# Altium project CAN to USB.PrjPcb
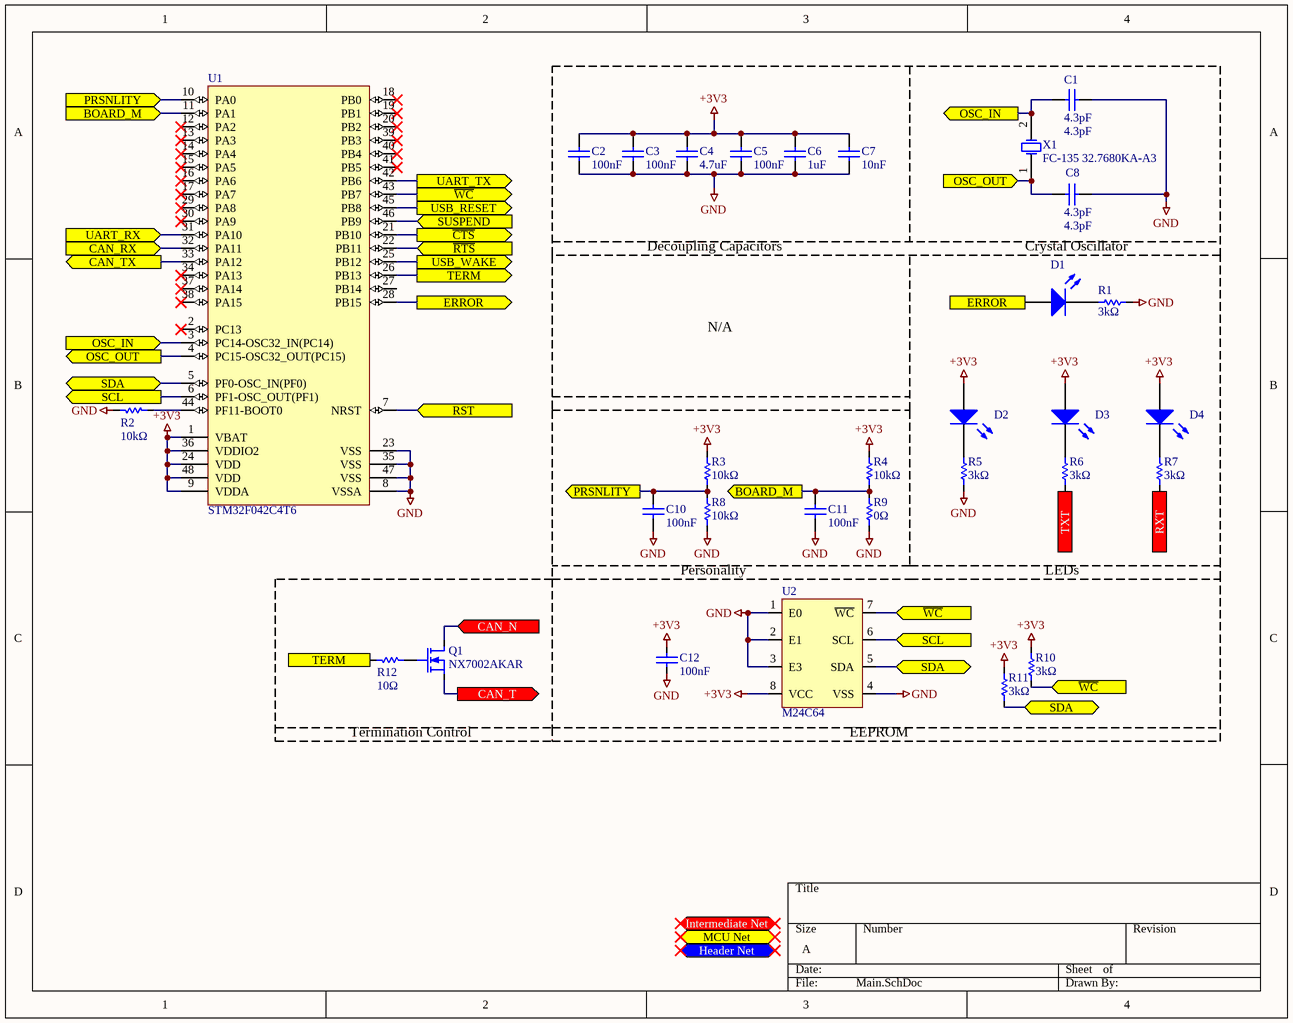
[diagram p0: Main.SchDoc]
3 sheets, 50 parts. Net scope: flat (ports and power ports of the same name join across sheets).
Board file: Can2USB.PcbDoc
Sheets:
  Main.SchDoc
  USB.SchDoc
  IO.SchDoc

## Sheet Main.SchDoc
size A; SheetNumber: 1; SheetTotal: 3

### Parts
C1  4.3pF  [1608[0603]]
C2  100nF  [1608[0603]]
C3  100nF  [1608[0603]]
C4  4.7uF  [1608[0603]]
C5  100nF  [1608[0603]]
C6  1uF  [1608[0603]]
C7  10nF  [1608[0603]]
C8  4.3pF  [1608[0603]]
C10  100nF  [1608[0603]]
C11  100nF  [1608[0603]]
C12  100nF  [1608[0603]]
D1  POWER_ON  [1608[0603]]  (value not drawn)
D2  POWER_ON  [1608[0603]]  (value not drawn)
D3  POWER_ON  [1608[0603]]  (value not drawn)
D4  POWER_ON  [1608[0603]]  (value not drawn)
Q1  NX7002AKAR  [SOT23-6_L]
R1  value 3kΩ  [1608[0603]]  (hidden comment: 4.7k)
R2  value 10kΩ  [1608[0603]]  (hidden comment: 10k)
R3  value 10kΩ  [1608[0603]]  (hidden comment: 10k)
R4  value 10kΩ  [1608[0603]]  (hidden comment: 10k)
R5  value 3kΩ  [1608[0603]]  (hidden comment: 4.7k)
R6  value 3kΩ  [1608[0603]]  (hidden comment: 4.7k)
R7  value 3kΩ  [1608[0603]]  (hidden comment: 4.7k)
R8  value 10kΩ  [1608[0603]]  (hidden comment: 10k)
R9  value 0Ω  [1608[0603]]  (hidden comment: 0 ohm)
R10  value 3kΩ  [1608[0603]]  (hidden comment: 3k)
R11  value 3kΩ  [1608[0603]]  (hidden comment: 3k)
R12  value 10Ω  [1608[0603]]  (hidden comment: 10k)
U1  STM32F042C4T6  [STM-LQFP48_M]
U2  M24C64  [SO8_M]
X1  FC-135 32.7680KA-A3  [ESPO-FC-135-2_V]

### Ports
BOARD_M (in), BOARD_M (out), CAN_N (in), CAN_RX (in), CAN_T (out), CAN_TX (out), ERROR (in), ERROR (out), Header Net (bidir), Intermediate Net (bidir), MCU Net (bidir), OSC_IN (in), OSC_IN (out), OSC_OUT (in), OSC_OUT (out), PRSNLITY (in), PRSNLITY (out), RST (in), RXT (out), SCL (in), SCL (out), SDA (bidir), SUSPEND (in), TERM (in), TERM (out), TXT (out), UART_RX (in), UART_TX (out), USB_RESET (out), USB_WAKE (out), ~{CTS} (out), ~{RTS} (in), ~{WC} (in), ~{WC} (out)

### Nets
+3V3: C2.1 C3.1 C4.1 C5.1 C6.1 C7.1 C12.1 D2.1(A) D3.1(A) D4.1(A) R3.2 R4.2 R10.1 R11.1 U1.1(VBAT) U1.9(VDDA) U1.24(VDD) U1.36(VDDIO2) U1.48(VDD) U2.8(VCC)
GND: C1.2 C2.2 C3.2 C4.2 C5.2 C6.2 C7.2 C8.2 C10.2 C11.2 C12.2 R1.2 R2.2 R5.2 R8.1 R9.1 U1.8(VSSA) U1.23(VSS) U1.35(VSS) U1.47(VSS) U2.1(E0) U2.2(E1) U2.3(E3) U2.4(VSS)
NetC1_1: C1.1 U1.3(PC14-OSC32_IN(PC14)) X1.2(X2) ; port OSC_IN
NetC8_1: C8.1 U1.4(PC15-OSC32_OUT(PC15)) X1.1(X1) ; port OSC_OUT
NetC10_1: C10.1 R3.1 R8.2 U1.10(PA0) ; port PRSNLITY
NetC11_1: C11.1 R4.1 R9.2 U1.11(PA1) ; port BOARD_M
NetD1_1: D1.1(A) U1.28(PB15) ; port ERROR
NetD1_2: D1.2(K) R1.1
NetD2_2: D2.2(K) R5.1
NetD3_2: D3.2(K) R6.1
NetD4_2: D4.2(K) R7.1
NetD5_2: Q1.1(D) ; port CAN_N
NetQ1_2: Q1.2(G) R12.1
NetQ1_3: Q1.3(S) ; port CAN_T
NetR2_1: R2.1 U1.44(PF11-BOOT0)
NetR6_2: R6.2 ; port TXT
NetR7_2: R7.2 ; port RXT
NetR10_2: R10.2 U1.43(PB7) U2.7(~{WC}) ; port ~{WC}
NetR11_2: R11.2 U1.5(PF0-OSC_IN(PF0)) U2.5(SDA) ; port SDA
NetR12_2: R12.2 U1.26(PB13) ; port TERM
NetR18_2: U1.22(PB11) ; port ~{RTS}
NetU1_6: U1.6(PF1-OSC_OUT(PF1)) U2.6(SCL) ; port SCL
NetU1_7: U1.7(NRST) ; port RST
NetU1_21: U1.21(PB10) ; port ~{CTS}
NetU1_25: U1.25(PB12) ; port USB_WAKE
NetU1_31: U1.31(PA10) ; port UART_RX
NetU1_32: U1.32(PA11) ; port CAN_RX
NetU1_33: U1.33(PA12) ; port CAN_TX
NetU1_42: U1.42(PB6) ; port UART_TX
NetU1_45: U1.45(PB8) ; port USB_RESET
NetU1_46: U1.46(PB9) ; port SUSPEND

Not connected (* = marked no-connect by the designer): U1 2(PC13)* 12(PA2)* 13(PA3)* 14(PA4)* 15(PA5)* 16(PA6)* 17(PA7)* 18(PB0)* 19(PB1)* 20(PB2)* 27(PB14) 29(PA8)* 30(PA9)* 34(PA13)* 37(PA14)* 38(PA15)* 39(PB3)* 40(PB4)* 41(PB5)*

### Notes on the sheet
- Decoupling Capacitors
- Crystal Oscillator
- N/A
- Personality
- LEDs
- Termination Control
- (near U2) EEPROM

### Library data of the parts
C1-C8 C10-C12 = Cap Semi: Capacitor (Semiconductor SIM Model); Published: 8-Jun-2000; LatestRevisionDate: 29-May-2009; LatestRevisionNote: IPC-7351 Footprint Added.; PackageReference: C1206; Publisher: Altium Limited; PackageDescription: Chip Capacitor
  C1 C8: Value: 4.3pF
  C2 C3 C5 C10-C12: Value: 100nF
  C4: Value: 4.7uF
  C6: Value: 1uF
  C7: Value: 10nF
D1-D4 = LED2: Typical RED, GREEN, YELLOW, AMBER GaAs LED; Published: 8-Jun-2000; LatestRevisionDate: 17-Jul-2002; LatestRevisionNote: Re-released for DXP Platform.; PackageVersion: Feb-2002; PackageReference: 3.2X1.6X1.1; Publisher: Altium Limited; PackageDescription: SM LED; 2 Flat Leads
Q1 = MOSFET-N: N-Channel MOSFET; Published: 8-Jun-2000; LatestRevisionDate: 17-Jul-2002; LatestRevisionNote: Re-released for DXP Platform.; PackageVersion: 1995/1996; PackageReference: E3; Publisher: Altium Limited; PackageDescription: TO, Flat Index; 3 In-Line, Axial Leads; Body Dia. 4.6mm; Lead Dia. 0.5 mm (max)
R1-R12 = Res1: Resistor; Published: 8-Jun-2000; LatestRevisionDate: 17-Jul-2002; LatestRevisionNote: Re-released for DXP Platform.; PackageReference: AXIAL-0.3; Publisher: Altium Limited; PackageDescription: Axial Device, Thru-Hole; 2 Leads; 0.3 in Pin Spacing
U1 = CMP-0304-00102-2: ARM Cortex-M0 32-bit MCU, 16 KB Flash, 6 KB Internal RAM, 38 I/Os, 48-Pin LQFP, -40 to 85 degC, Tray; Manufacturer: STMicroelectronics; Operating Frequency(F) (Processor speed) (MHz): 48; FLASH Size (Prog) (kB): 16; Internal RAM Size (kB): 6; I/Os (High Current): 38; Supply Voltage(Vcc) min (V): 2; ComponentLink1Description: Manufacturer URL; Packing: Tray; ComponentLink2Description: Datasheet; ComponentLink2URL: http://www.st.com/st-web-ui/static/active/en/resource/technical/document/datasheet/DM00105814.pdf; DatasheetVersion: Rev. 5; ComponentLink1URL: http://www.st.com/; Package Reference: LQFP48; Mounting Technology: Surface Mount; Package Description: 48-Pin Low Profile Quad Flat Package, Body 7 x 7 mm, Pitch 0.5 mm; Core: ARM Cortex-M0; PartNumber: STM32F042C4T6
U2 = M24C64-RMN6P: EEPROM I2C 64k
X1 = CMP-2000-05107-1: Crystal, 32.768 KHz, 12.5 pF, -40 to 85 degC, 2-Pin SMD, RoHS, Tape and Reel; Manufacturer: Epson; Load Capacitance: 12.5pF; Frequency Stability: 20PPM; Drive Level: 0.5uW; Unit Weight: 0.000564oz; Brand: EpsonTiming; ESR: 65kOhms; Series: FC-135R/FC-135/FC-255; Height: 0.8mm; Operating Temperature Range: -40Cto+85C; Package / Case: 3.2mmx1.5mm; Factory Pack Quantity: 250; Product Category: Crystals; Frequency: 32.768kHz; Type: kHzCrystal; Package Description: 2-Pin Surface Mount Device, Body 3.2 x 1.5 mm; Width: 1.5mm; RoHS: True; Manufacturer URL: https://www.eea.epson.com/; Package Reference: FC-135; Datasheet Version: Nov-12; Tolerance: 20PPM; Mounting Style: SMD/SMT; Length: 3.2mm; Termination Style: SMD/SMT; Packaging: Reel; Datasheet URL: https://datasheet.ciiva.com/15116/getdatasheetpartid-112713-15116373.pdf

## Sheet USB.SchDoc
size A; SheetNumber: 2; SheetTotal: 3
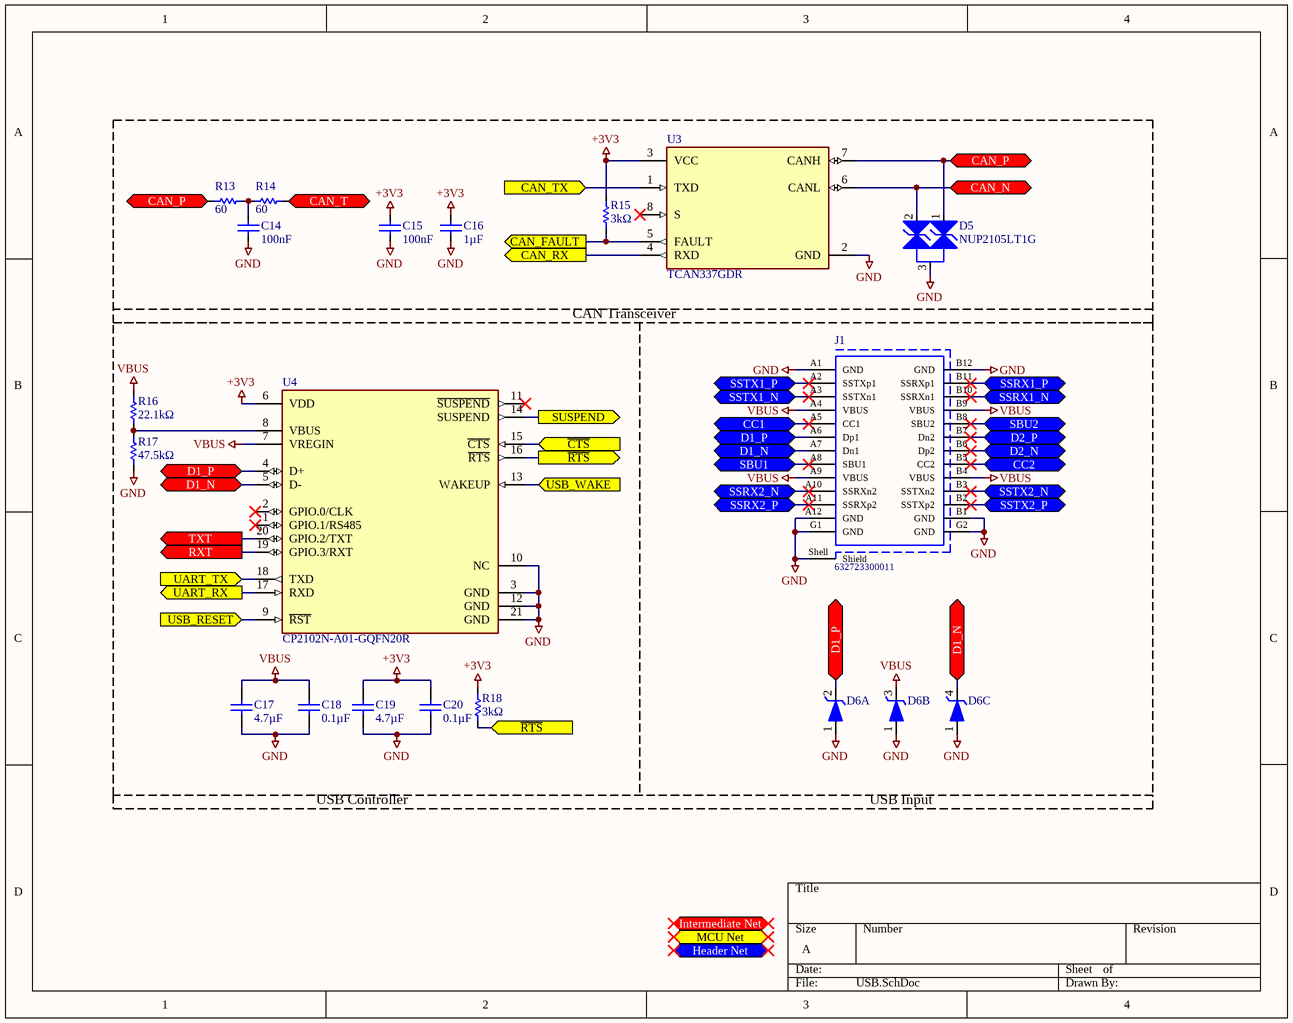
[diagram p1: USB.SchDoc]

### Parts
C14  100nF  [1608[0603]]
C15  100nF  [1608[0603]]
C16  value 1µF  [1608[0603]]  (hidden comment: 100nF)
C17  value 4.7µF  [1608[0603]]  (hidden comment: 100nF)
C18  value 0.1µF  [1608[0603]]  (hidden comment: 100nF)
C19  value 4.7µF  [1608[0603]]  (hidden comment: 100nF)
C20  value 0.1µF  [1608[0603]]  (hidden comment: 100nF)
D5  NUP2105LT1G  [ONSC-SOT-23-3-318-08_V]
D6  SP0503BAHTG  [SOT143]  (value not drawn)  (parts A,B,C of 3)
J1  632723300011  [632723300011]
R13  value 60  [1608[0603]]  (hidden comment: 60 ohm)
R14  value 60  [1608[0603]]  (hidden comment: 60 ohm)
R15  value 3kΩ  [1608[0603]]  (hidden comment: 3k)
R16  value 22.1kΩ  [1608[0603]]  (hidden comment: 3k)
R17  value 47.5kΩ  [1608[0603]]  (hidden comment: 3k)
R18  value 3kΩ  [1608[0603]]  (hidden comment: 3k)
U3  TCAN337GDR  [FP-D0008A-IPC_C]
U4  CP2102N-A01-GQFN20R  [FP-CP2102N-A01-GQFN20R-MFG]

### Blocks framed on the sheet
CAN Transceiver: C14-C16 D5 R13-R15 U3

### Ports
CAN_FAULT (out), CAN_N (bidir), CAN_P (bidir), CAN_RX (out), CAN_T (bidir), CAN_TX (in), CC1 (bidir), CC2 (bidir), D1_N (bidir), D1_P (bidir), D2_N (bidir), D2_P (bidir), Header Net (bidir), Intermediate Net (bidir), MCU Net (bidir), RXT (out), SBU1 (bidir), SBU2 (bidir), SSRX1_N (bidir), SSRX1_P (bidir), SSRX2_N (bidir), SSRX2_P (bidir), SSTX1_N (bidir), SSTX1_P (bidir), SSTX2_N (bidir), SSTX2_P (bidir), SUSPEND (out), TXT (out), UART_RX (out), UART_TX (in), USB_RESET (in), USB_WAKE (in), ~{CTS} (in), ~{RTS} (in), ~{RTS} (out)

### Nets
+3V3: C15.1 C16.1 C19.1 C20.1 R15.1 R18.1 U3.3(VCC) U4.6(VDD)
GND: C14.2 C15.2 C16.2 C17.2 C18.2 C19.2 C20.2 D5.3(K) D6.1 J1.A1(GND) J1.A12(GND) J1.B1(GND) J1.B12(GND) J1.G1(GND) J1.G2(GND) J1.Shell(Shield) R17.2 U3.2(GND) U4.3(GND) U4.10(NC) U4.12(GND) U4.21(GND)
VBUS: C17.1 C18.1 D6.3 J1.A4(VBUS) J1.A9(VBUS) J1.B4(VBUS) J1.B9(VBUS) R16.1 U4.7(VREGIN)
NetC14_1: C14.1 R13.1 R14.2
NetD5_1: D5.1(K) R13.2 U3.7(CANH) ; port CAN_P
NetD5_2: D5.2(K) U3.6(CANL) ; port CAN_N
NetD6_2: D6.2 J1.A6(Dp1) U4.4(D+) ; port D1_P
NetD6_4: D6.4 J1.A7(Dn1) U4.5(D-) ; port D1_N
NetJ1_A2: J1.A2(SSTXp1) ; port SSTX1_P
NetJ1_A3: J1.A3(SSTXn1) ; port SSTX1_N
NetJ1_A5: J1.A5(CC1) ; port CC1
NetJ1_A8: J1.A8(SBU1) ; port SBU1
NetJ1_A10: J1.A10(SSRXn2) ; port SSRX2_N
NetJ1_A11: J1.A11(SSRXp2) ; port SSRX2_P
NetJ1_B2: J1.B2(SSTXp2) ; port SSTX2_P
NetJ1_B3: J1.B3(SSTXn2) ; port SSTX2_N
NetJ1_B5: J1.B5(CC2) ; port CC2
NetJ1_B6: J1.B6(Dp2) ; port D2_N
NetJ1_B7: J1.B7(Dn2) ; port D2_P
NetJ1_B8: J1.B8(SBU2) ; port SBU2
NetJ1_B10: J1.B10(SSRXn1) ; port SSRX1_N
NetJ1_B11: J1.B11(SSRXp1) ; port SSRX1_P
NetQ1_3: R14.1 ; port CAN_T
NetR6_2: U4.20(GPIO.2/TXT) ; port TXT
NetR7_2: U4.19(GPIO.3/RXT) ; port RXT
NetR15_2: R15.2 U3.5(FAULT) ; port CAN_FAULT
NetR16_2: R16.2 R17.1 U4.8(VBUS)
NetR18_2: R18.2 U4.16(~{RTS}) ; port ~{RTS}
NetU1_21: U4.15(~{CTS}) ; port ~{CTS}
NetU1_25: U4.13(WAKEUP) ; port USB_WAKE
NetU1_31: U4.17(RXD) ; port UART_RX
NetU1_32: U3.4(RXD) ; port CAN_RX
NetU1_33: U3.1(TXD) ; port CAN_TX
NetU1_42: U4.18(TXD) ; port UART_TX
NetU1_45: U4.9(~{RST}) ; port USB_RESET
NetU1_46: U4.14(SUSPEND) ; port SUSPEND

Not connected (* = marked no-connect by the designer): U3 8(S)*; U4 1(GPIO.1/RS485)* 2(GPIO.0/CLK)* 11(~{SUSPEND})*

### Notes on the sheet
- USB Controller
- USB Input

### Library data of the parts
C14-C20 = Cap Semi: Capacitor (Semiconductor SIM Model); Published: 8-Jun-2000; LatestRevisionDate: 29-May-2009; LatestRevisionNote: IPC-7351 Footprint Added.; PackageReference: C1206; Publisher: Altium Limited; PackageDescription: Chip Capacitor
  C14 C15: Value: 100nF
D5 = CMP-1063-00164-1: Dual Line CAN Bus Protector, 3-Pin SOT-23, Pb-Free, Tape and Reel; Manufacturer: On Semiconductor; IR Max (uA): 0.1; Number of Lines: 2; Direction: Bidirectional; C Max (pF): 30; PPK Max (W): 350; V(BR) Min (V): 26.2; ComponentLink3URL: http://www.onsemi.cn/pub_link/Collateral/318-08.PDF; Mounting Technology: Surface Mount; ComponentLink2Description: Datasheet; PartNumber: NUP2105LT1G; ComponentLink1URL: http://www.onsemi.com/; PackageVersion: Rev. AP, 11/2009; DatasheetVersion: Rev. 5; RoHS: Pb-Free; PackageReference: SOT-23-3-318-08; ComponentLink2URL: http://www.onsemi.cn/pub_link/Collateral/NUP2105L-D.PDF; ComponentLink1Description: Manufacturer URL; PackageDescription: 3-Pin Small Outline Transistor, Body 2.92 x 1.3 mm, Pitch 0.95 mm; Packing: Tape and Reel; ComponentLink3Description: Package Specification
D6 = LFUS-SP0503BAHTG-SOT143-4: TVS Diode Array, 30 pF, 30 KV, -40 to 85 degC, 4-Pin SOT143, RoHS, Tape and Reel; Manufacturer: Littelfuse; Direction Type: Uni-Directional; Product Height (mm): 1.05mm; Leakage Current (Max): 0.1uA; Clamping Voltage (Max): 8V; Reverse Stand-off Voltage: 5.5(Min)V; Configuration: Triple; Working Voltage: 5.5V; Product Length (mm): 3.04mm; Working Voltage (Max): 5.5V(Min); Capacitance Value: 30pF; Rad Hardened: No; Number of Elements: 3; Product Depth (mm): 1.4mm; Operating Temperature Max Deg. C: 85C; Suppressor Type: TVS; Operating Temperature Min Deg. C: -40C; Operating Temp Range: -40Cto85C; Mounting: SurfaceMount; Package / Case: SOT-143; Datasheet Version: Dec-13; Package Type: SOT-143; Packaging: TapeandReel; Pin Count: 3+Tab; Operating Temperature Classification: Industrial; Datasheet URL: https://datasheet.ciiva.com/15143/getdatasheetpartid-116020-15143550.pdf; Manufacturer URL: http://www.littelfuse.com/; Leakage Current: 0.1uA; Mounting Style: SurfaceMount; Clamping Voltage: 8V; Polarity: Uni-Directional
J1 = CMP-1502-03214-1: USB 3.1 Type C Receptacle WR-COM, Horizontal, SMT / THT; Manufacturer: Wurth Elektronik; Rated Current: 5A; Contact Resistance: 30mOhm; Working Voltage: 20VDC; Operating Temperature: -40to105degC; Package Reference: 632723300011; Datasheet URL: https://katalog.we-online.de/em/datasheet/632723x00011%282%29.pdf; Manufacturer URL: http://www.we-online.de; Connector Type: USB3.1TypeC; Gender: Receptacle; Part Number: 632723300011; Mounting Technology: SMT/THT; Publisher: WurthElektronik; Packaging: TapeandReel; Orientation: Horizontal
R13-R18 = Res1: Resistor; Published: 8-Jun-2000; LatestRevisionDate: 17-Jul-2002; LatestRevisionNote: Re-released for DXP Platform.; PackageReference: AXIAL-0.3; Publisher: Altium Limited; PackageDescription: Axial Device, Thru-Hole; 2 Leads; 0.3 in Pin Spacing
U3 = CMP-04872-000068-1: IC TRANSCEIVER 1/1 8SOIC; Max Supply Voltage: 3.6V; Min Supply Voltage: 3V; Interface: CAN; REACH SVHC: No SVHC; Case/Package: SOIC; RoHS Compliant: Yes; Packaging: Cut Tape; Max Operating Temperature: 125°C; Number of Pins: 8; Lead Free: Lead Free; Min Operating Temperature: -40°C
U4 = CMP-08093-000003-1: IC BRIDGE USB TO UART 20QFN; Manufacturer: Silicon Labs; Nominal Supply Current: 9.5-13.7mA; Usb Standard: USB 2.0; Standoff Height: 0mm; Min Supply Voltage: 1.71V; Max Supply Voltage: 5.25V; Interface: UART,USB; Data Rate: 3Mbits/s; Number Of Ports: 1; Max Junction Temp: +105°C; Package: CP2102N-A01-GQFN20R; Octopart: https://octopart.com/cp2102n-a01-gqfn20r-silicon+labs-76789142; Height: 0.8mm; Category: IC; Temperature: -40°C to +85°C; Ambient Temperature Range Low: -40°C; ComponentLink2URL: https://www.silabs.com/documents/public/data-sheets/cp2102n-datasheet.pdf; Temperature Range Low: -40°C; RoHS: TRUE; Device Class L2: Interface ICs; Ambient Temperature Range High: +85°C; Device Class L3: USB Interface ICs; Mouser Description: USB to USRT Bridge Controller 20-Pin QFN T/R; Lead Free: Yes; Device Class L1: Integrated Circuits (ICs); Digikey Description: IC BRIDGE USB TO UART 20QFN; Temperature Range High: +85°C; Manufacturer Part Number: CP2102N-A01-GQFN20R; ComponentLink2Description: Datasheet; Automotive: No

## Sheet IO.SchDoc
size A; SheetNumber: 3; SheetTotal: 3
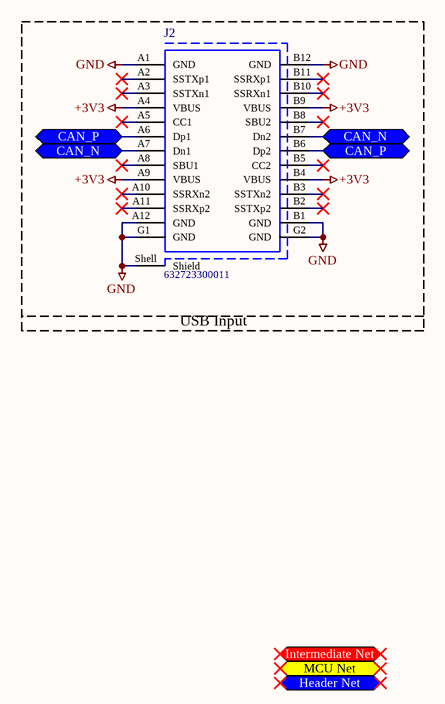
[diagram p2: IO.SchDoc]

### Parts
J2  632723300011  [632723300011]

### Blocks framed on the sheet
USB Input: J2

### Ports
CAN_N (bidir), CAN_P (bidir), Header Net (bidir), Intermediate Net (bidir), MCU Net (bidir)

### Nets
+3V3: J2.A4(VBUS) J2.A9(VBUS) J2.B4(VBUS) J2.B9(VBUS)
GND: J2.A1(GND) J2.A12(GND) J2.B1(GND) J2.B12(GND) J2.G1(GND) J2.G2(GND) J2.Shell(Shield)
NetD5_1: J2.A6(Dp1) J2.B6(Dp2) ; port CAN_P
NetD5_2: J2.A7(Dn1) J2.B7(Dn2) ; port CAN_N

Not connected (* = marked no-connect by the designer): J2 A2(SSTXp1)* A3(SSTXn1)* A5(CC1)* A8(SBU1)* A10(SSRXn2)* A11(SSRXp2)* B2(SSTXp2)* B3(SSTXn2)* B5(CC2)* B8(SBU2)* B10(SSRXn1)* B11(SSRXp1)*

### Library data of the parts
J2 = CMP-1502-03214-1: as J1 on sheet USB; Operating Temperature: -40to105degC; Package Reference: 632723300011; Datasheet URL: https://katalog.we-online.de/em/datasheet/632723x00011%282%29.pdf; Manufacturer URL: http://www.we-online.de; Connector Type: USB3.1TypeC; Gender: Receptacle; Part Number: 632723300011; Mounting Technology: SMT/THT; Publisher: WurthElektronik; Packaging: TapeandReel; Orientation: Horizontal

## Nets that join several sheets
+3V3: Main (20 pins), USB (8 pins), IO (J2.A4 J2.A9 J2.B4 J2.B9)
GND: Main (24 pins), USB (22 pins), IO (7 pins)
NetD5_1: USB (D5.1 R13.2 U3.7), IO (J2.A6 J2.B6)
NetD5_2: Main (Q1.1), USB (D5.2 U3.6), IO (J2.A7 J2.B7)
NetQ1_3: Main (Q1.3), USB (R14.1)
NetR6_2: Main (R6.2), USB (U4.20)
NetR7_2: Main (R7.2), USB (U4.19)
NetR18_2: Main (U1.22), USB (R18.2 U4.16)
NetU1_21: Main (U1.21), USB (U4.15)
NetU1_25: Main (U1.25), USB (U4.13)
NetU1_31: Main (U1.31), USB (U4.17)
NetU1_32: Main (U1.32), USB (U3.4)
NetU1_33: Main (U1.33), USB (U3.1)
NetU1_42: Main (U1.42), USB (U4.18)
NetU1_45: Main (U1.45), USB (U4.9)
NetU1_46: Main (U1.46), USB (U4.14)